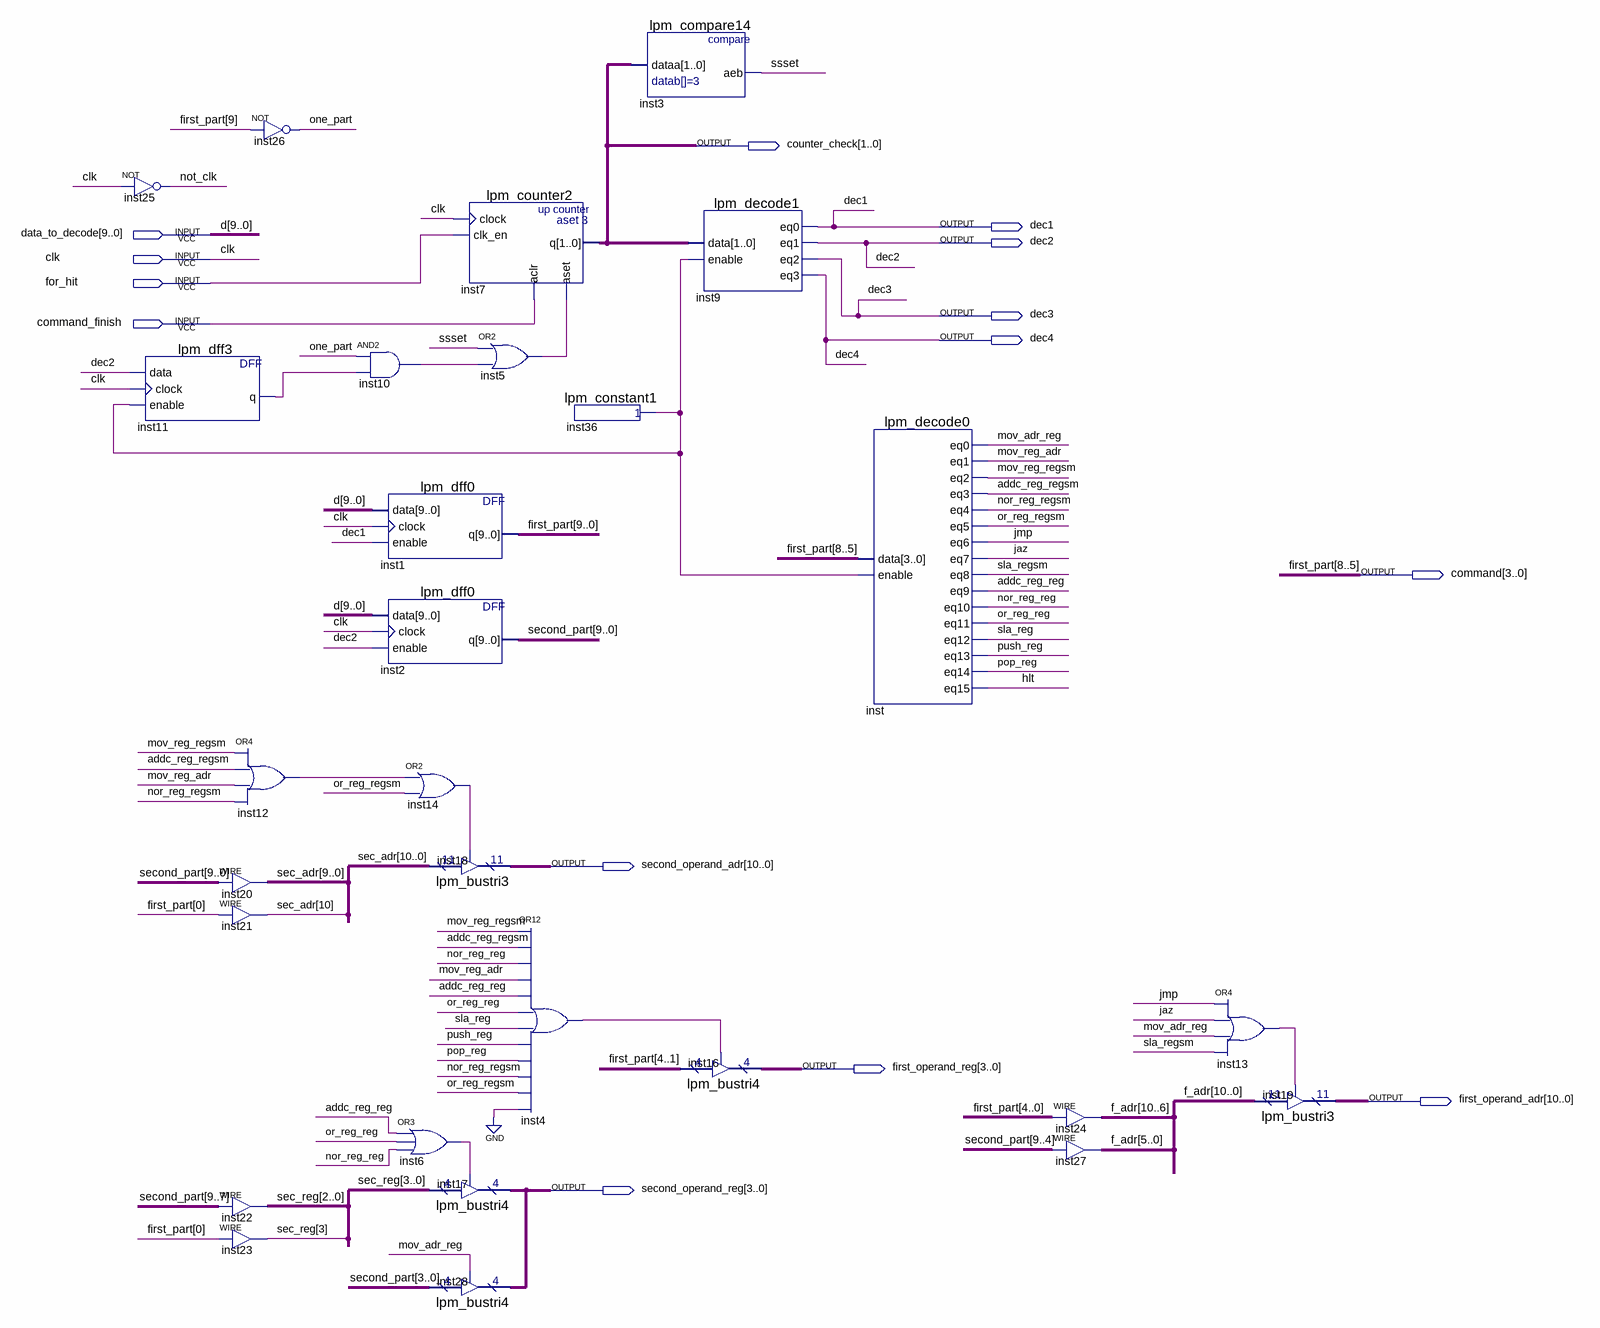
[diagram p0: schematic sheet]
// Quartus schematic Command_decoder.bdf as structural Verilog: 28 symbols, 14 pins
module Command_decoder (
  input  [9:0] data_to_decode,
  input  clk,
  input  for_hit,
  input  command_finish,
  output [1:0] counter_check,
  output dec1,
  output dec2,
  output dec3,
  output dec4,
  output [3:0] command,
  output [10:0] second_operand_adr,
  output [3:0] first_operand_reg,
  output [10:0] first_operand_adr,
  output [3:0] second_operand_reg
);

  wire addc_reg_reg, addc_reg_regsm, hlt, inst4_out, inst5_out, inst6_out, inst10_out, inst11_q, inst12_out,
       inst13_out, inst14_out, inst36_result, jaz, jmp, mov_adr_reg, mov_reg_adr, mov_reg_regsm, nor_reg_reg,
       nor_reg_regsm, not_clk, one_part, or_reg_reg, or_reg_regsm, pop_reg, push_reg, sla_reg, sla_regsm,
       ssset;
  wire [3:0] sec_reg;
  wire [9:0] first_part, second_part;
  wire [10:0] f_adr, sec_adr;

  not inst25 (not_clk, clk);
  lpm_dff3 inst11 (.data(dec2), .clock(clk), .enable(inst36_result), .q(inst11_q));
  assign sec_adr[9:0] = second_part;  // WIRE inst20
  assign sec_adr[10] = first_part[0];  // WIRE inst21
  assign sec_reg[2:0] = second_part[9:7];  // WIRE inst22
  assign sec_reg[3] = first_part[0];  // WIRE inst23
  not inst26 (one_part, first_part[9]);
  or inst12 (inst12_out, mov_reg_regsm, addc_reg_regsm, mov_reg_adr, nor_reg_regsm);
  and inst10 (inst10_out, one_part, inst11_q);
  lpm_dff0 inst1 (.data(data_to_decode), .clock(clk), .enable(dec1), .q({first_part[9], command, first_part[4:0]}));
  lpm_dff0 inst2 (.data(data_to_decode), .clock(clk), .enable(dec2), .q(second_part));
  or inst14 (inst14_out, inst12_out, or_reg_regsm);
  or inst6 (inst6_out, addc_reg_reg, or_reg_reg, nor_reg_reg);
  lpm_counter2 inst7 (.clock(clk), .clk_en(for_hit), .aclr(command_finish), .aset(inst5_out), .q(counter_check));
  or inst5 (inst5_out, ssset, inst10_out);
  lpm_bustri3 inst18 (.enabledt(inst14_out), .data(sec_adr), .tridata(second_operand_adr));
  lpm_bustri4 inst17 (.enabledt(inst6_out), .data(sec_reg), .tridata(second_operand_reg));
  lpm_bustri4 inst28 (.enabledt(mov_adr_reg), .data(second_part[3:0]), .tridata(second_operand_reg));
  or inst4 (inst4_out, mov_reg_regsm, addc_reg_regsm, nor_reg_reg, mov_reg_adr, addc_reg_reg, or_reg_reg, sla_reg, push_reg, pop_reg, nor_reg_regsm, or_reg_regsm, 1'b0);
  lpm_constant1 inst36 (.result(inst36_result));
  lpm_compare14 inst3 (.dataa(counter_check), .aeb(ssset));
  lpm_decode1 inst9 (.data(counter_check), .enable(inst36_result), .eq0(dec1), .eq1(dec2), .eq2(dec3), .eq3(dec4));
  lpm_bustri4 inst16 (.enabledt(inst4_out), .data(first_part[4:1]), .tridata(first_operand_reg));
  lpm_decode0 inst (
    .data(command), .enable(inst36_result), .eq0(mov_adr_reg), .eq1(mov_reg_adr), .eq2(mov_reg_regsm),
    .eq3(addc_reg_regsm), .eq4(nor_reg_regsm), .eq5(or_reg_regsm), .eq6(jmp), .eq7(jaz), .eq8(sla_regsm),
    .eq9(addc_reg_reg), .eq10(nor_reg_reg), .eq11(or_reg_reg), .eq12(sla_reg), .eq13(push_reg),
    .eq14(pop_reg), .eq15(hlt));
  assign f_adr[10:6] = first_part[4:0];  // WIRE inst24
  assign f_adr[5:0] = second_part[9:4];  // WIRE inst27
  or inst13 (inst13_out, jmp, jaz, mov_adr_reg, sla_regsm);
  lpm_bustri3 inst19 (.enabledt(inst13_out), .data(f_adr), .tridata(first_operand_adr));

  // Other names for the same wires on the sheet: d[9:0] = data_to_decode; first_part[8:5] = command
endmodule
